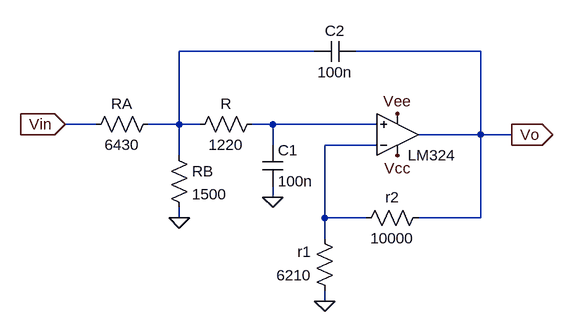
[diagram p0: schematic Draft2.asc]
Draft2.asc, the LTspice schematic file:
Version 4.1
SHEET 1 880 680
WIRE 144 -96 -64 -96
WIRE 400 -96 208 -96
WIRE -192 16 -240 16
WIRE -64 16 -64 -96
WIRE -64 16 -112 16
WIRE -32 16 -64 16
WIRE 80 16 48 16
WIRE 240 16 80 16
WIRE 400 32 400 -96
WIRE 400 32 304 32
WIRE 448 32 400 32
WIRE 80 48 80 16
WIRE 240 48 160 48
WIRE -64 64 -64 16
WIRE 80 128 80 112
WIRE -64 160 -64 144
WIRE 160 160 160 48
WIRE 224 160 160 160
WIRE 400 160 400 32
WIRE 400 160 304 160
WIRE 160 192 160 160
WIRE 160 288 160 272
FLAG 80 128 0
FLAG 160 288 0
FLAG -240 16 Vin
IOPIN -240 16 In
FLAG 448 32 Vo
IOPIN 448 32 Out
FLAG -64 160 0
FLAG 272 64 Vcc
FLAG 272 0 Vee
SYMBOL OpAmps\\opamp2 272 96 M180
SYMATTR InstName LM324
SYMATTR Value ""
SYMBOL res -96 0 R90
WINDOW 0 0 56 VBottom 2
WINDOW 3 32 56 VTop 2
SYMATTR InstName RA
SYMATTR Value 6430
SYMBOL res 64 0 R90
WINDOW 0 0 56 VBottom 2
WINDOW 3 32 56 VTop 2
SYMATTR InstName R
SYMATTR Value 1220
SYMBOL res 320 144 R90
WINDOW 0 0 56 VBottom 2
WINDOW 3 32 56 VTop 2
SYMATTR InstName r2
SYMATTR Value 10000
SYMBOL res 176 288 R180
WINDOW 0 36 76 Left 2
WINDOW 3 36 40 Left 2
SYMATTR InstName r1
SYMATTR Value 6210
SYMBOL cap 64 48 R0
SYMATTR InstName C1
SYMATTR Value 100n
SYMBOL cap 208 -112 R90
WINDOW 0 0 32 VBottom 2
WINDOW 3 32 32 VTop 2
SYMATTR InstName C2
SYMATTR Value 100n
SYMBOL res -80 48 R0
SYMATTR InstName RB
SYMATTR Value 1500

The netlist it stands for:
* Draft2.asc
X§LM324 N002 N003 Vcc Vee Vo opamp2  ; pins In+ In- V+ V- OUT
RA N001 Vin 6430
R N002 N001 1220
r2 Vo N003 10000
r1 0 N003 6210
C1 N002 0 100n
C2 Vo N001 100n
RB N001 0 1500
.backanno
.end